# EAGLE design TouScruino-ui2.IL-v0 (EAGLE 6.3)
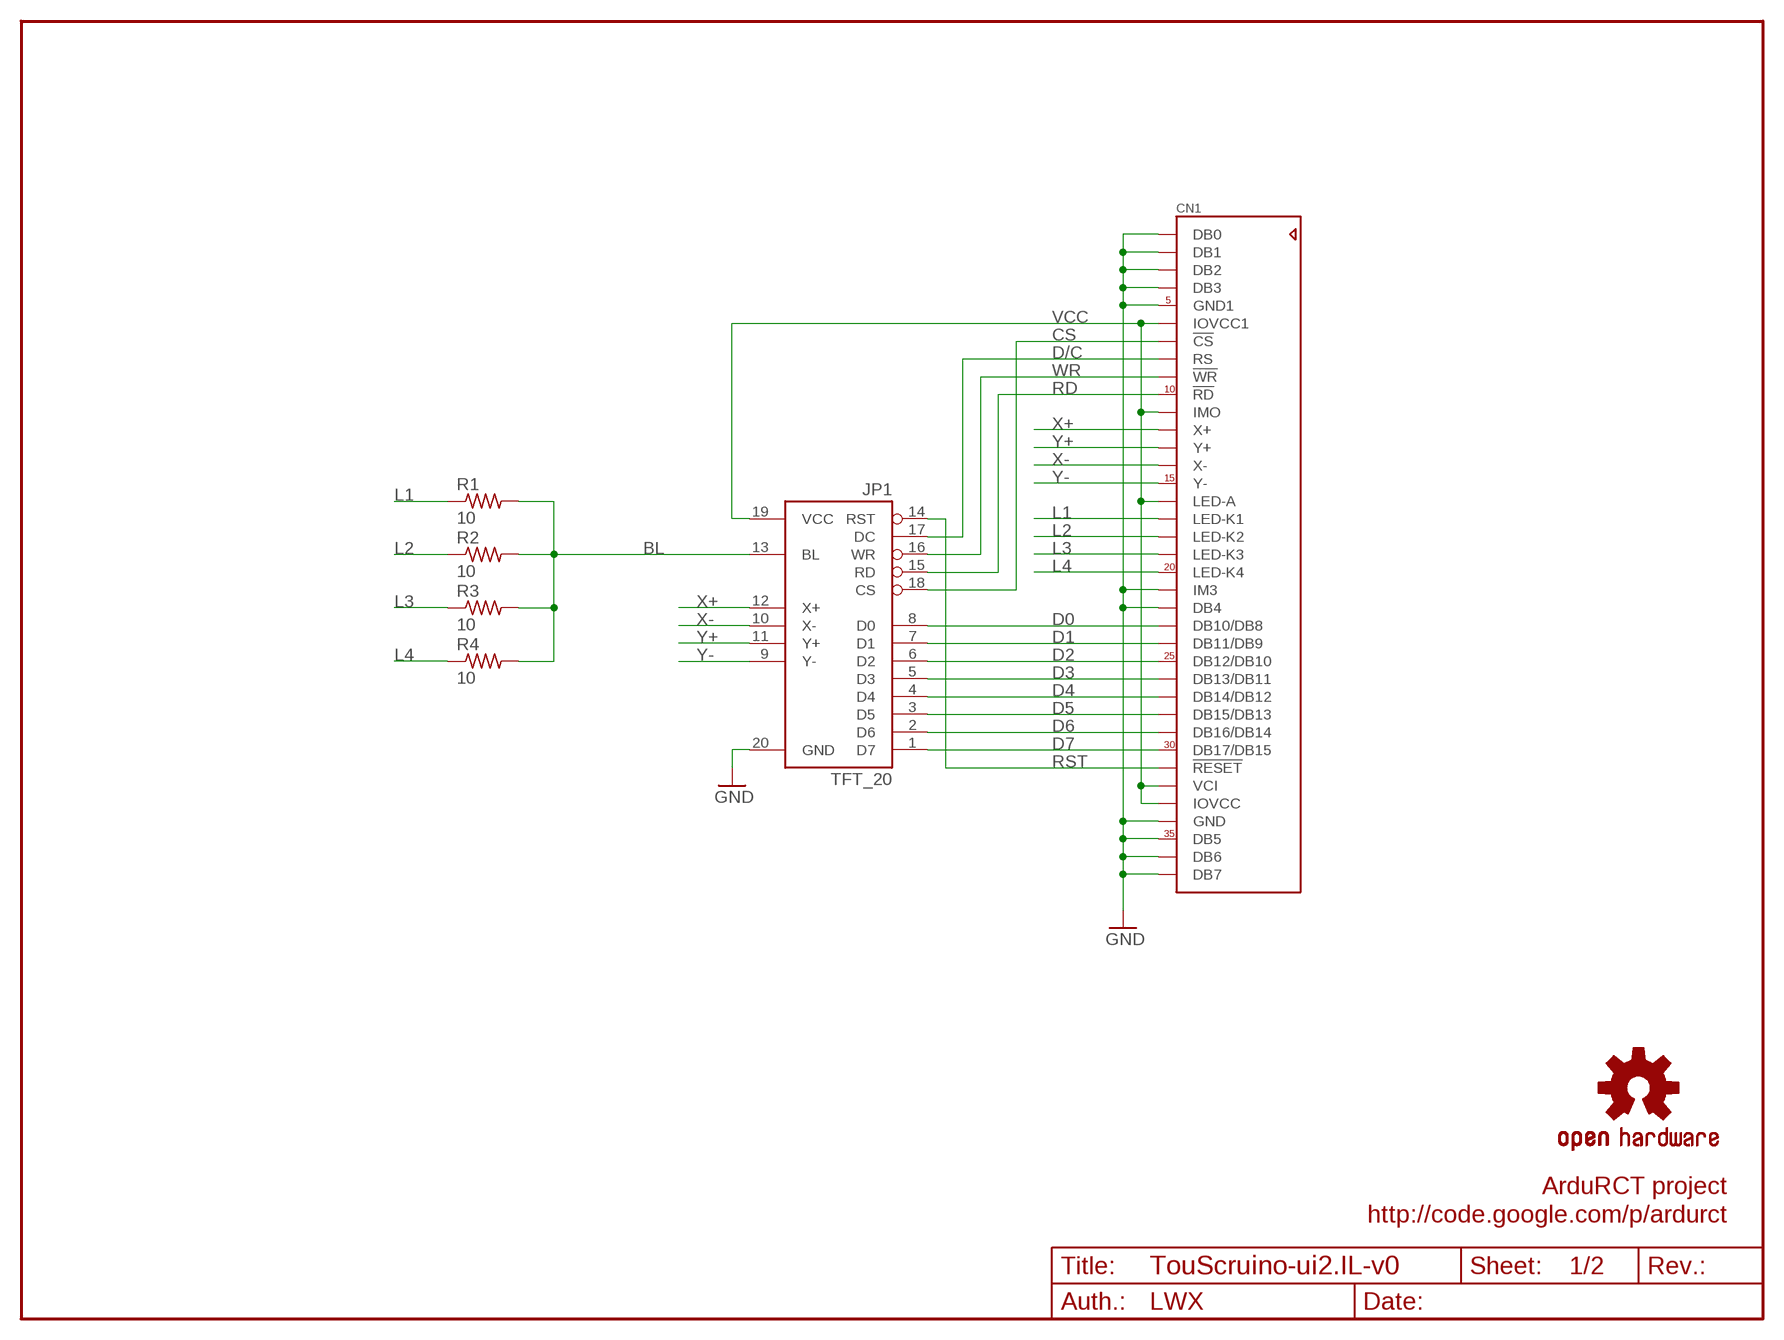
[diagram p0: schematic, sheet 1]

## Parts
CN1  ILI9325_LCD1.0MM  [ILI9325_28INCH_TS]
JP1  TFT_20  [TFT_20]
R1  10  R-US_R0603  [R0603]
R2  10  R-US_R0603  [R0603]
R3  10  R-US_R0603  [R0603]
R4  10  R-US_R0603  [R0603]
U$3  OSHW-LOGOM  [OSHW-LOGO-M]

## Nets
BL: JP1.13(BL) R1.2 R2.2 R3.2 R4.2
CS: CN1.7(!CS) JP1.18(CS)
D0: CN1.23(DB10/DB8) JP1.8(D0)
D1: CN1.24(DB11/DB9) JP1.7(D1)
D2: CN1.25(DB12/DB10) JP1.6(D2)
D3: CN1.26(DB13/DB11) JP1.5(D3)
D4: CN1.27(DB14/DB12) JP1.4(D4)
D5: CN1.28(DB15/DB13) JP1.3(D5)
D6: CN1.29(DB16/DB14) JP1.2(D6)
D7: CN1.30(DB17/DB15) JP1.1(D7)
D/C: CN1.8(RS) JP1.17(DC)
GND: CN1.1(DB0) CN1.2(DB1) CN1.3(DB2) CN1.4(DB3) CN1.5(GND1) CN1.21(IM3) CN1.22(DB4) CN1.34(GND) CN1.35(DB5) CN1.36(DB6) CN1.37(DB7) JP1.20(GND)
L1: CN1.17(LED-K1) R1.1
L2: CN1.18(LED-K2) R2.1
L3: CN1.19(LED-K3) R3.1
L4: CN1.20(LED-K4) R4.1
RD: CN1.10(!RD) JP1.15(RD)
RST: CN1.31(!RESET) JP1.14(RST)
VCC: CN1.6(IOVCC1) CN1.11(IMO) CN1.16(LED-A) CN1.32(VCI) CN1.33(IOVCC) JP1.19(VCC)
WR: CN1.9(!WR) JP1.16(WR)
X+: CN1.12(X+) JP1.12(X+)
X-: CN1.14(X-) JP1.10(X-)
Y+: CN1.13(Y+) JP1.11(Y+)
Y-: CN1.15(Y-) JP1.9(Y-)

## Notes on the sheet
- ArduRCT project
- http://code.google.com/p/ardurct
- 1/2
- LWX

## Library data of the parts
CN1 = adafruit:ILI9325_LCD: 2.8" ILI9325-based TFT LCD w/Integrated Touch Screen
JP1 = wibauxl:TFT_20
R1-R4 = resistor:R-US_: RESISTOR, American symbol
U$3 = SparkFun:OSHW-LOGO: Open Source Hardware Logo This logo indicates the piece of hardware it is found on incorporates a OSHW license and/or adheres to the definition of open source hardware found here: http://freedomdefined.org/OSHW

## Net classes
0 default: width 0.203 mm
1 vcc: width 0.254 mm

## Board
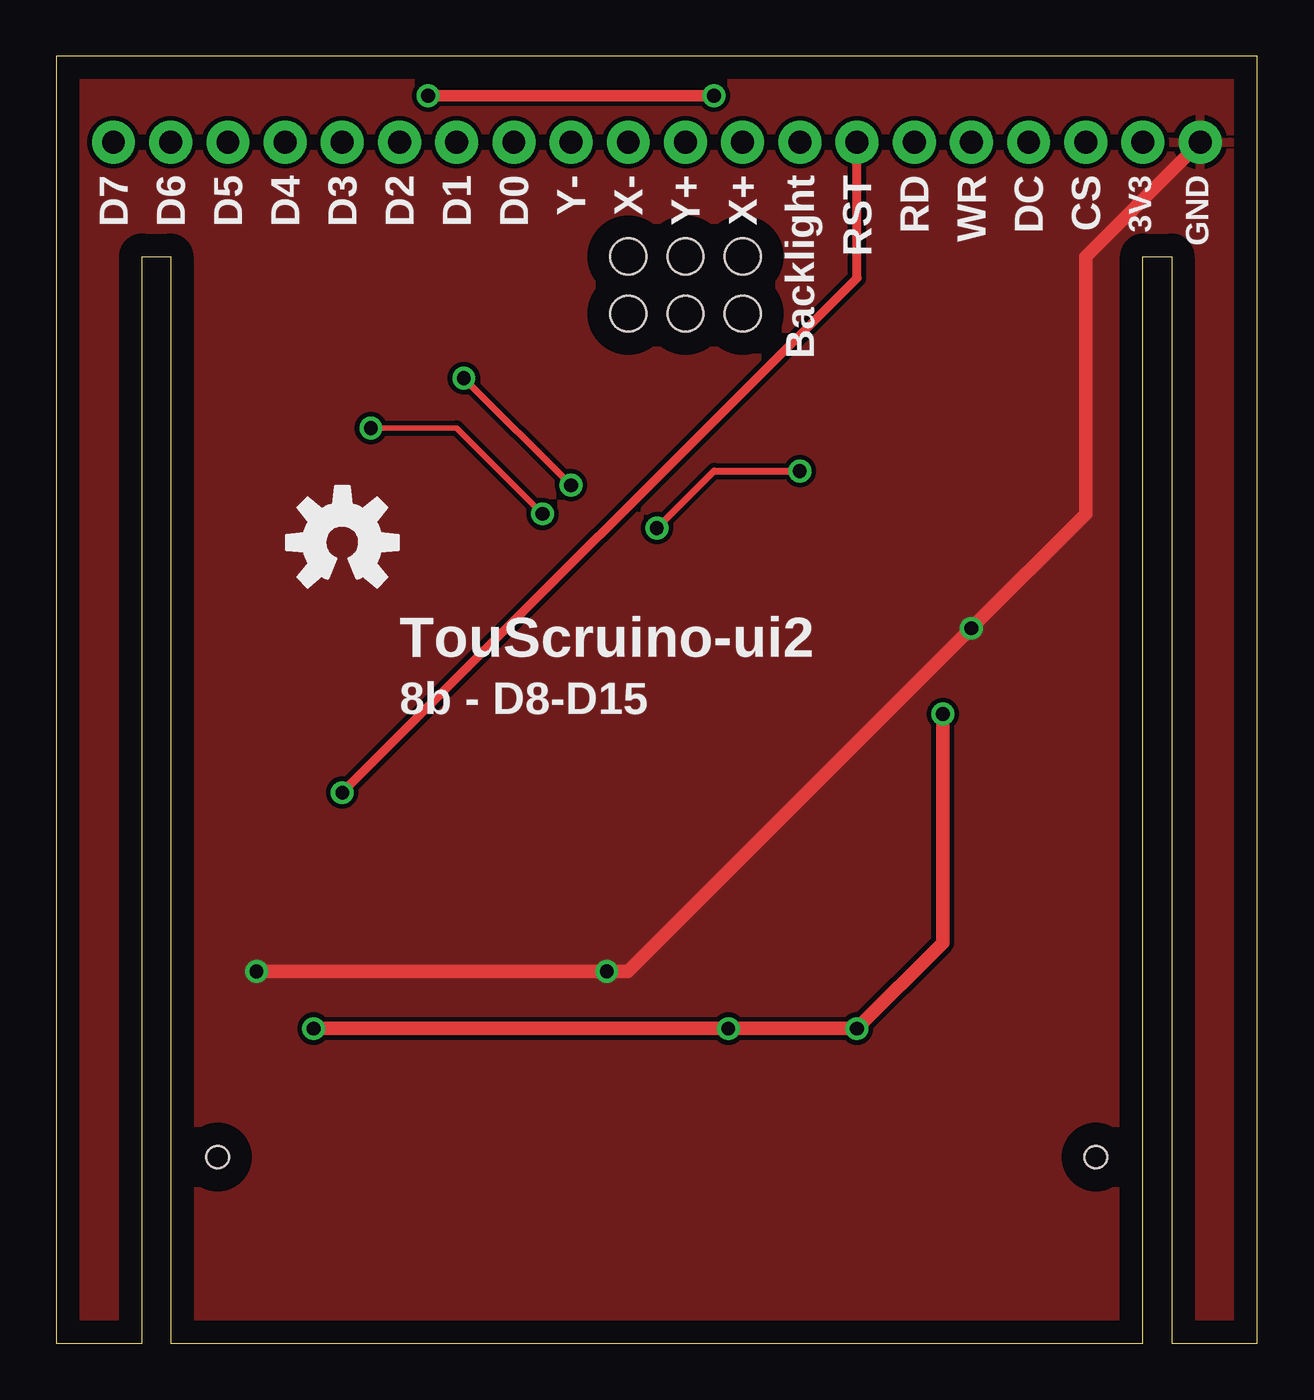
[diagram p1: board, top side]
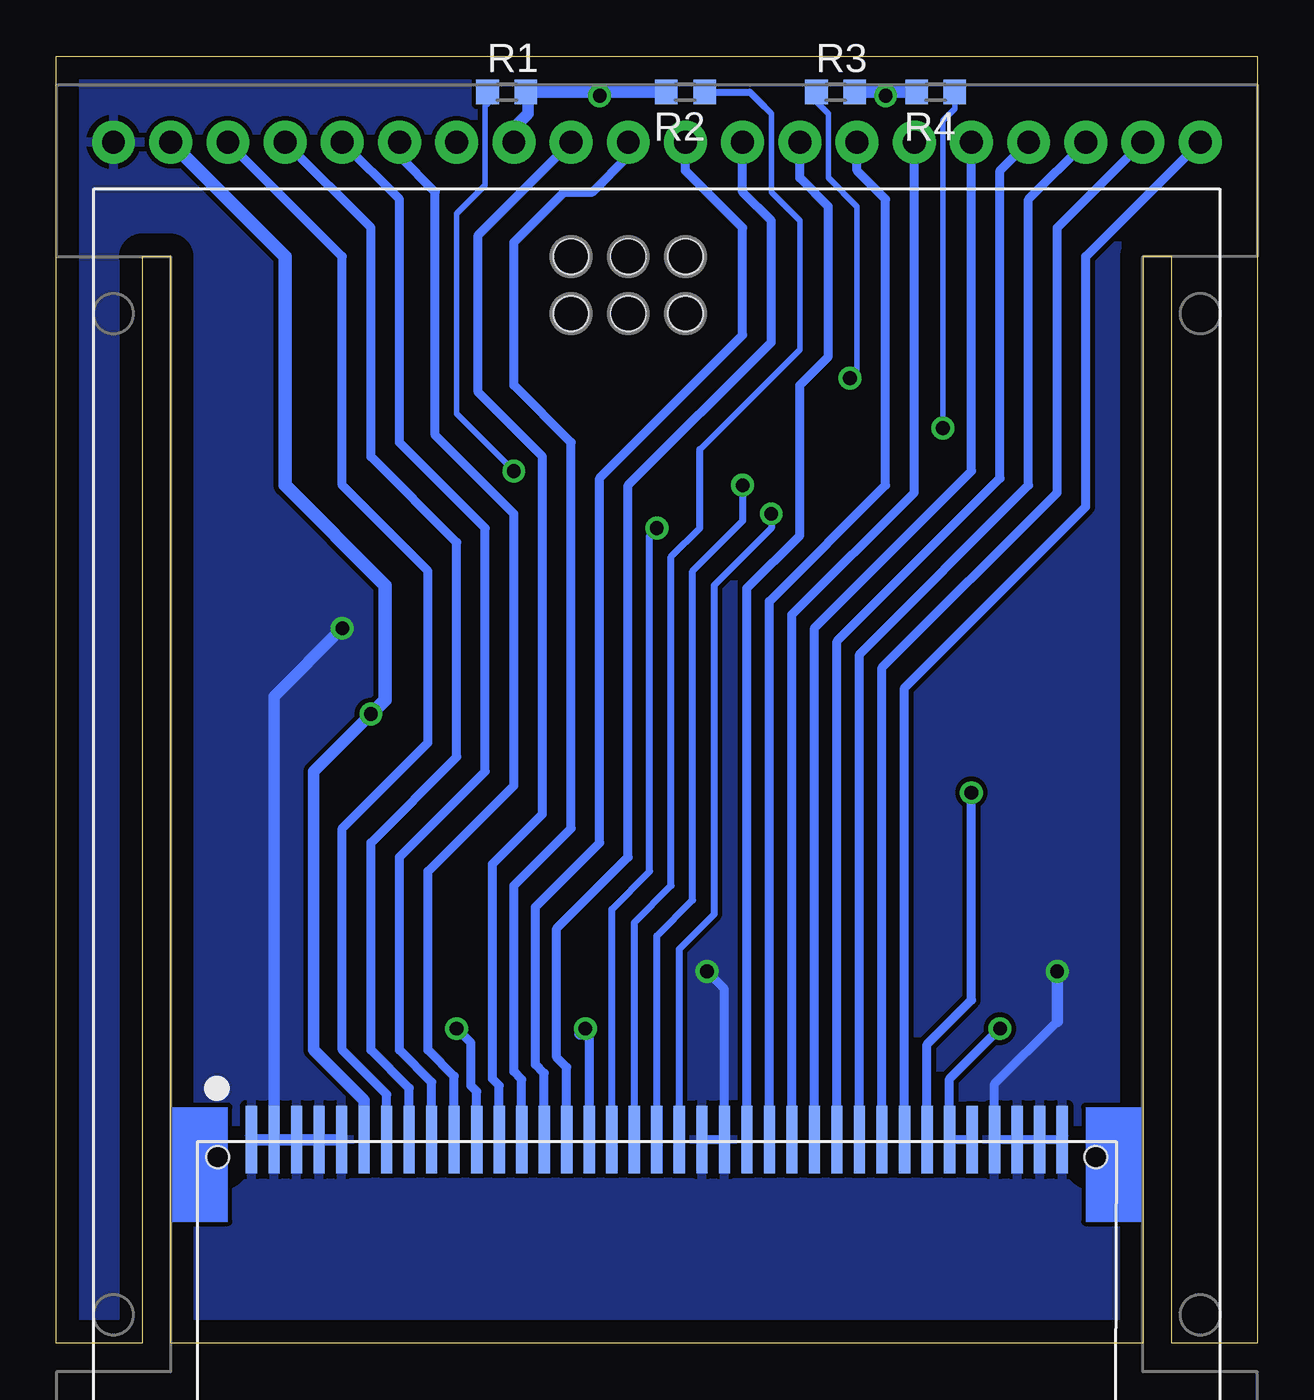
[diagram p2: board, bottom side, seen from below]

Size 53.34 x 57.15 mm. Coordinates in mm from the lower left corner, seen from the top.
Outline: 53.34,0 53.34,57.15 0,57.15 0,0 3.81,0 3.81,48.26 5.08,48.26 5.08,0 48.26,0 48.26,48.26 49.53,48.26 49.53,0 53.34,0
Copper layers (1*16): Top 0.035mm / dielectric 1.5mm / Bottom 0.035mm
Design rules "default": minimum track width 10mil, minimum drill 24mil, track to track 8mil, track to pad 8mil, pad to pad 8mil, via to via 8mil, smd to smd 8mil, copper to edge 40mil, drill to drill 8mil, minimum pad ring 10mil, minimum via ring 8mil, stop-mask expansion 4mil, vias tented up to drill 0mil, thermal gap 10mil
Holes 1.6 mm at 25.4,48.26 27.94,48.26 30.48,48.26 30.48,45.72 27.94,45.72 25.4,45.72

### Footprints (pad centres in the part's own frame; a part is rotated, then mirrored left to right if it is on the bottom)
ILI9325_28INCH_TS = smd 0.5 x 3: 1 -18,27.77; 2 -17,27.77; 3 -16,27.77; 4 -15,27.77; 5 -14,27.77; 6 -13,27.77; 7 -12,27.77; 8 -11,27.77; 9 -10,27.77; 10 -9,27.77; 11 -8,27.77; 12 -7,27.77; 13 -6,27.77; 14 -5,27.77; 15 -4,27.77; 16 -3,27.77; 17 -2,27.77; 18 -1,27.77; 19 0,27.77; 20 1,27.77; 21 2,27.77; 22 3,27.77; 23 4,27.77; 24 5,27.77; 25 6,27.77; 26 7,27.77; 27 8,27.77; 28 9,27.77; 29 10,27.77; 30 11,27.77; 31 12,27.77; 32 13,27.77; 33 14,27.77; 34 15,27.77; 35 16,27.77; 36 17,27.77; 37 18,27.77 | hole 1: -19.5,27; 19.5,27
TFT_20 = drill 1.016 pad 1.905: 1 0,0; 2 -2.54,0; 3 -5.08,0; 4 -7.62,0; 5 -10.16,0; 6 -12.7,0; 7 -15.24,0; 8 -17.78,0; 9 -20.32,0; 10 -22.86,0; 11 -25.4,0; 12 -27.94,0; 13 -30.48,0; 14 -33.02,0; 15 -35.56,0; 16 -38.1,0; 17 -40.64,0; 18 -43.18,0; 19 -45.72,0; 20 -48.26,0
R0603 = smd 1 x 1.1: 1 -0.85,0; 2 0.85,0

### Placement (x,y rotation side)
CN1  26.67,-18.73 0 bottom
JP1  2.54,53.34 0 bottom
R1  33.34,55.56 0 bottom
R2  25.4,55.56 180 bottom
R3  18.73,55.56 0 bottom
R4  14.29,55.56 180 bottom
U$3  12.7,35.56 0 top

### Tracks (layer width: path | path; a pad name or v marks a point on that pad's centre or on a via)
BL  (via drill 0.61)
  Top 0.508: v16.51,55.4 v29.21,55.4
  Bottom 0.508: R2.2 29.05,55.56 | 29.37,55.56 v29.21,55.4 29.05,55.56 | 29.05,55.56 29.37,55.56 | 29.37,55.56 R1.2 32.38,55.46 32.38,54.61 33.02,53.98 JP1.13 | v16.51,55.4 16.45,55.51 16.35,55.56 | R4.2 16.35,55.56 | 16.35,55.56 v16.51,55.4 | v16.51,55.4 16.67,55.56 R3.2
CS
  Bottom 0.406: JP1.18 40.64,48.26 40.64,38.1 36.83,34.29 36.83,26.67 40.64,22.86 40.64,13.02 38.67,11.05 CN1.7
D0
  Bottom 0.406: JP1.8 20.32,51.75 19.05,50.48 19.05,43.81 20.32,42.55 20.32,35.88 22.67,33.53 CN1.23
D1
  Bottom 0.406: JP1.7 17.78,52.07 16.51,50.8 16.51,38.1 21.67,32.94 CN1.24
D2
  Bottom 0.406: JP1.6 15.24,37.78 20.67,32.35 CN1.25
D3
  Bottom 0.406: JP1.5 12.7,38.73 19.67,31.77 CN1.26
D4
  Bottom 0.406: JP1.4 11.43,52.07 11.43,38.42 18.67,31.18 CN1.27
D5
  Bottom 0.406: JP1.3 10.16,50.8 10.16,38.1 17.67,30.59 CN1.28
D6
  Bottom 0.406: JP1.2 8.89,49.53 8.89,37.78 16.67,30 CN1.29
D7
  Bottom 0.406: JP1.1 7.62,48.26 7.62,37.15 15.67,29.1 CN1.30
D/C
  Bottom 0.406: JP1.17 39.37,49.53 39.37,39.37 35.56,35.56 35.56,26.04 39.37,22.23 39.37,13.02 37.67,11.32 CN1.8
GND  (via drill 0.61)
  Top 0.61: JP1.20 45.72,48.26 45.72,36.83 v40.64,31.75 25.4,16.51 v24.45,16.51 v8.89,16.51
  Bottom 0.406: CN1.37 CN1.36 CN1.35 CN1.34 11.67,11.51 8.89,14.29 | v24.45,16.51 23.67,15.73 CN1.22 CN1.21
  Bottom 0.508: 8.89,14.29 v8.89,16.51 | v40.64,31.75 43.67,28.72 CN1.2 | CN1.5 CN1.4 CN1.3 CN1.2 | CN1.2 CN1.1
  pour Bottom: 0,60.96 53.34,60.96 53.34,-2.54 0,-2.54
  pour Top: 0,59.69 53.34,59.69 53.34,-1.27 0,-1.27
L1  (via drill 0.61)
  Top 0.305: v26.67,36.2 29.21,38.73 v33.02,38.73
  Bottom 0.254: R1.1 34.19,55.03 34.29,54.93 34.29,51.44 35.56,50.16 35.56,41.27 v33.02,38.73
  Bottom 0.305: v26.67,36.2 26.99,35.88 26.99,20.95 28.67,19.27 CN1.17
L2
  Bottom 0.254: 22.33,55.35 21.91,54.93 21.59,54.61 21.59,51.12 20.32,49.85 20.32,44.13 24.77,39.69
  Bottom 0.305: 24.77,39.69 24.77,36.2 26.04,34.92 26.04,20.32 27.67,18.68 CN1.18 | R2.1 22.54,55.56 21.91,54.93
L3  (via drill 0.61)
  Top 0.305: v18.1,42.86 v22.86,38.1
  Bottom 0.254: R3.1 19.68,55.24 | 19.68,55.56 19.68,55.24 | 19.68,55.24 19.05,54.61 19.05,51.75 17.78,50.48 17.78,43.18 v18.1,42.86
  Bottom 0.305: v22.86,38.1 22.86,36.51 25.08,34.29 25.08,19.68 26.67,18.1 CN1.19
L4  (via drill 0.61)
  Top 0.254: v13.97,40.64 17.78,40.64 v21.59,36.83
  Bottom 0.254: R4.1 13.44,54.83 13.97,54.29 v13.97,40.64
  Bottom 0.305: v21.59,36.83 21.59,36.2 24.13,33.66 24.13,19.05 25.67,17.51 CN1.20
RD
  Bottom 0.406: JP1.15 38.1,52.7 36.51,51.12 36.51,40.32 33.02,36.83 33.02,24.77 36.83,20.95 36.83,13.02 35.67,11.86 CN1.10
RST  (via drill 0.61)
  Top 0.406: JP1.14 35.56,47.31 v12.7,24.45
  Bottom 0.406: v12.7,24.45 12.7,15.24 14.67,13.27 CN1.31
VCC  (via drill 0.61)
  Top 0.61: v11.43,13.97 v29.84,13.97 v35.56,13.97 39.37,17.78 v39.37,27.94
  Bottom 0.406: v35.56,13.97 34.92,13.34 34.92,11.43 34.67,11.18 CN1.11 | CN1.33 CN1.32 13.67,11.73 v11.43,13.97 | CN1.16 29.67,13.79 v29.84,13.97
  Bottom 0.508: 30.07,13.74 v29.84,13.97 | v39.37,27.94 41.91,25.4 41.91,13.02 39.67,10.78 CN1.6
  Bottom 0.61: JP1.19 43.18,48.26 43.18,38.1 38.73,33.66 38.73,28.57 v39.37,27.94
WR
  Bottom 0.406: JP1.16 38.1,50.8 38.1,40.01 34.29,36.2 34.29,25.4 38.1,21.59 38.1,13.02 36.67,11.59 CN1.9
X+
  Bottom 0.406: JP1.12 34.61,49.21 34.61,42.23 31.75,39.37 31.75,23.5 33.97,21.27 33.97,11.75 33.67,11.45 CN1.12
X-
  Bottom 0.406: JP1.10 25.4,52.07 22.86,49.53 22.86,44.77 29.21,38.42 29.21,22.23 32.07,19.37 32.07,12.38 31.67,11.98 CN1.14
Y+
  Bottom 0.406: JP1.11 27.94,52.7 29.53,51.12 30.8,51.12 33.02,48.9 33.02,42.55 30.48,40.01 30.48,22.86 33.02,20.32 33.02,12.06 32.67,11.71 CN1.13
Y-
  Bottom 0.406: JP1.9 22.86,51.12 21.59,49.85 21.59,44.45 27.94,38.1 27.94,21.59 31.11,18.41 31.11,12.7 30.67,12.26 CN1.15

### Text on the board
tPlace: D7 | D6 | D5 | D4 | D3 | D2 | D1 | D0 | Y- | X- | Y+ | X+ | Backlight | RST | RD | WR | DC | CS | 3V3 | GND | TouScruino-ui2 | 8b - D8-D15